# Altium schematic sheet temp_filt.SchDoc: RDT Filter
size A4; Date: 27.05.2014; Author: Stefan Lüthi; DrawnBy: Author; Organization: BFH; Address1: Bern University of Applied Sciences; Address2: Engineering and Information Technology; Address3: Jlcoweg 1; Address4: CH-3400 Burgdorf; DocumentNumber: 1; Revision: 1.0; SheetNumber: 4; SheetTotal: 8; CurrentDate: 27.05.2014
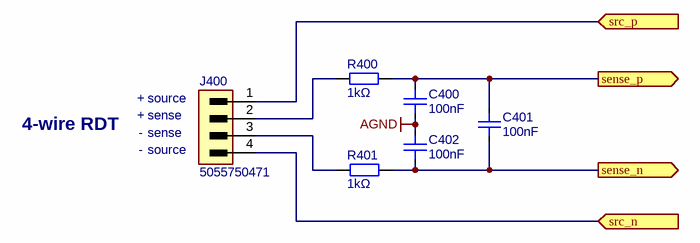
[diagram p0: temp_filt.SchDoc]

## Parts
C400  100nF  [SMD0603CAP]
C401  100nF  [SMD0603CAP]
C402  100nF  [SMD0603CAP]
J400  5055750471  [5055750471]
R400  1kΩ  [SMD0603RES]
R401  1kΩ  [SMD0603RES]

## Ports
sense_n (out), sense_p (out), src_n (in), src_p (in)

## Nets
AGND: C400.2 C402.1
sense_n: C401.2 C402.2 R401.1 ; port sense_n
sense_p: C400.1 C401.1 R400.1 ; port sense_p
src_n: J400.4 ; port src_n
src_p: J400.1 ; port src_p
NetJ400_2: J400.2 R400.2
NetJ400_3: J400.3 R401.2

## Notes on the sheet
- 4-wire RDT
- +
- -
- (near J400) source
- (near J400) sense
- Author:
- Title:
- Number:
- Product:
- Sheet
- of
- Variant:
- Revision:
- File:
- Template:
- A4SL CC-BY-SA (07-17)

## Library data of the parts
C400-C402 = Capacitor Ceramic: Ceramic Capacitor
J400 = Connector 4x1P
R400 R401 = Resistor